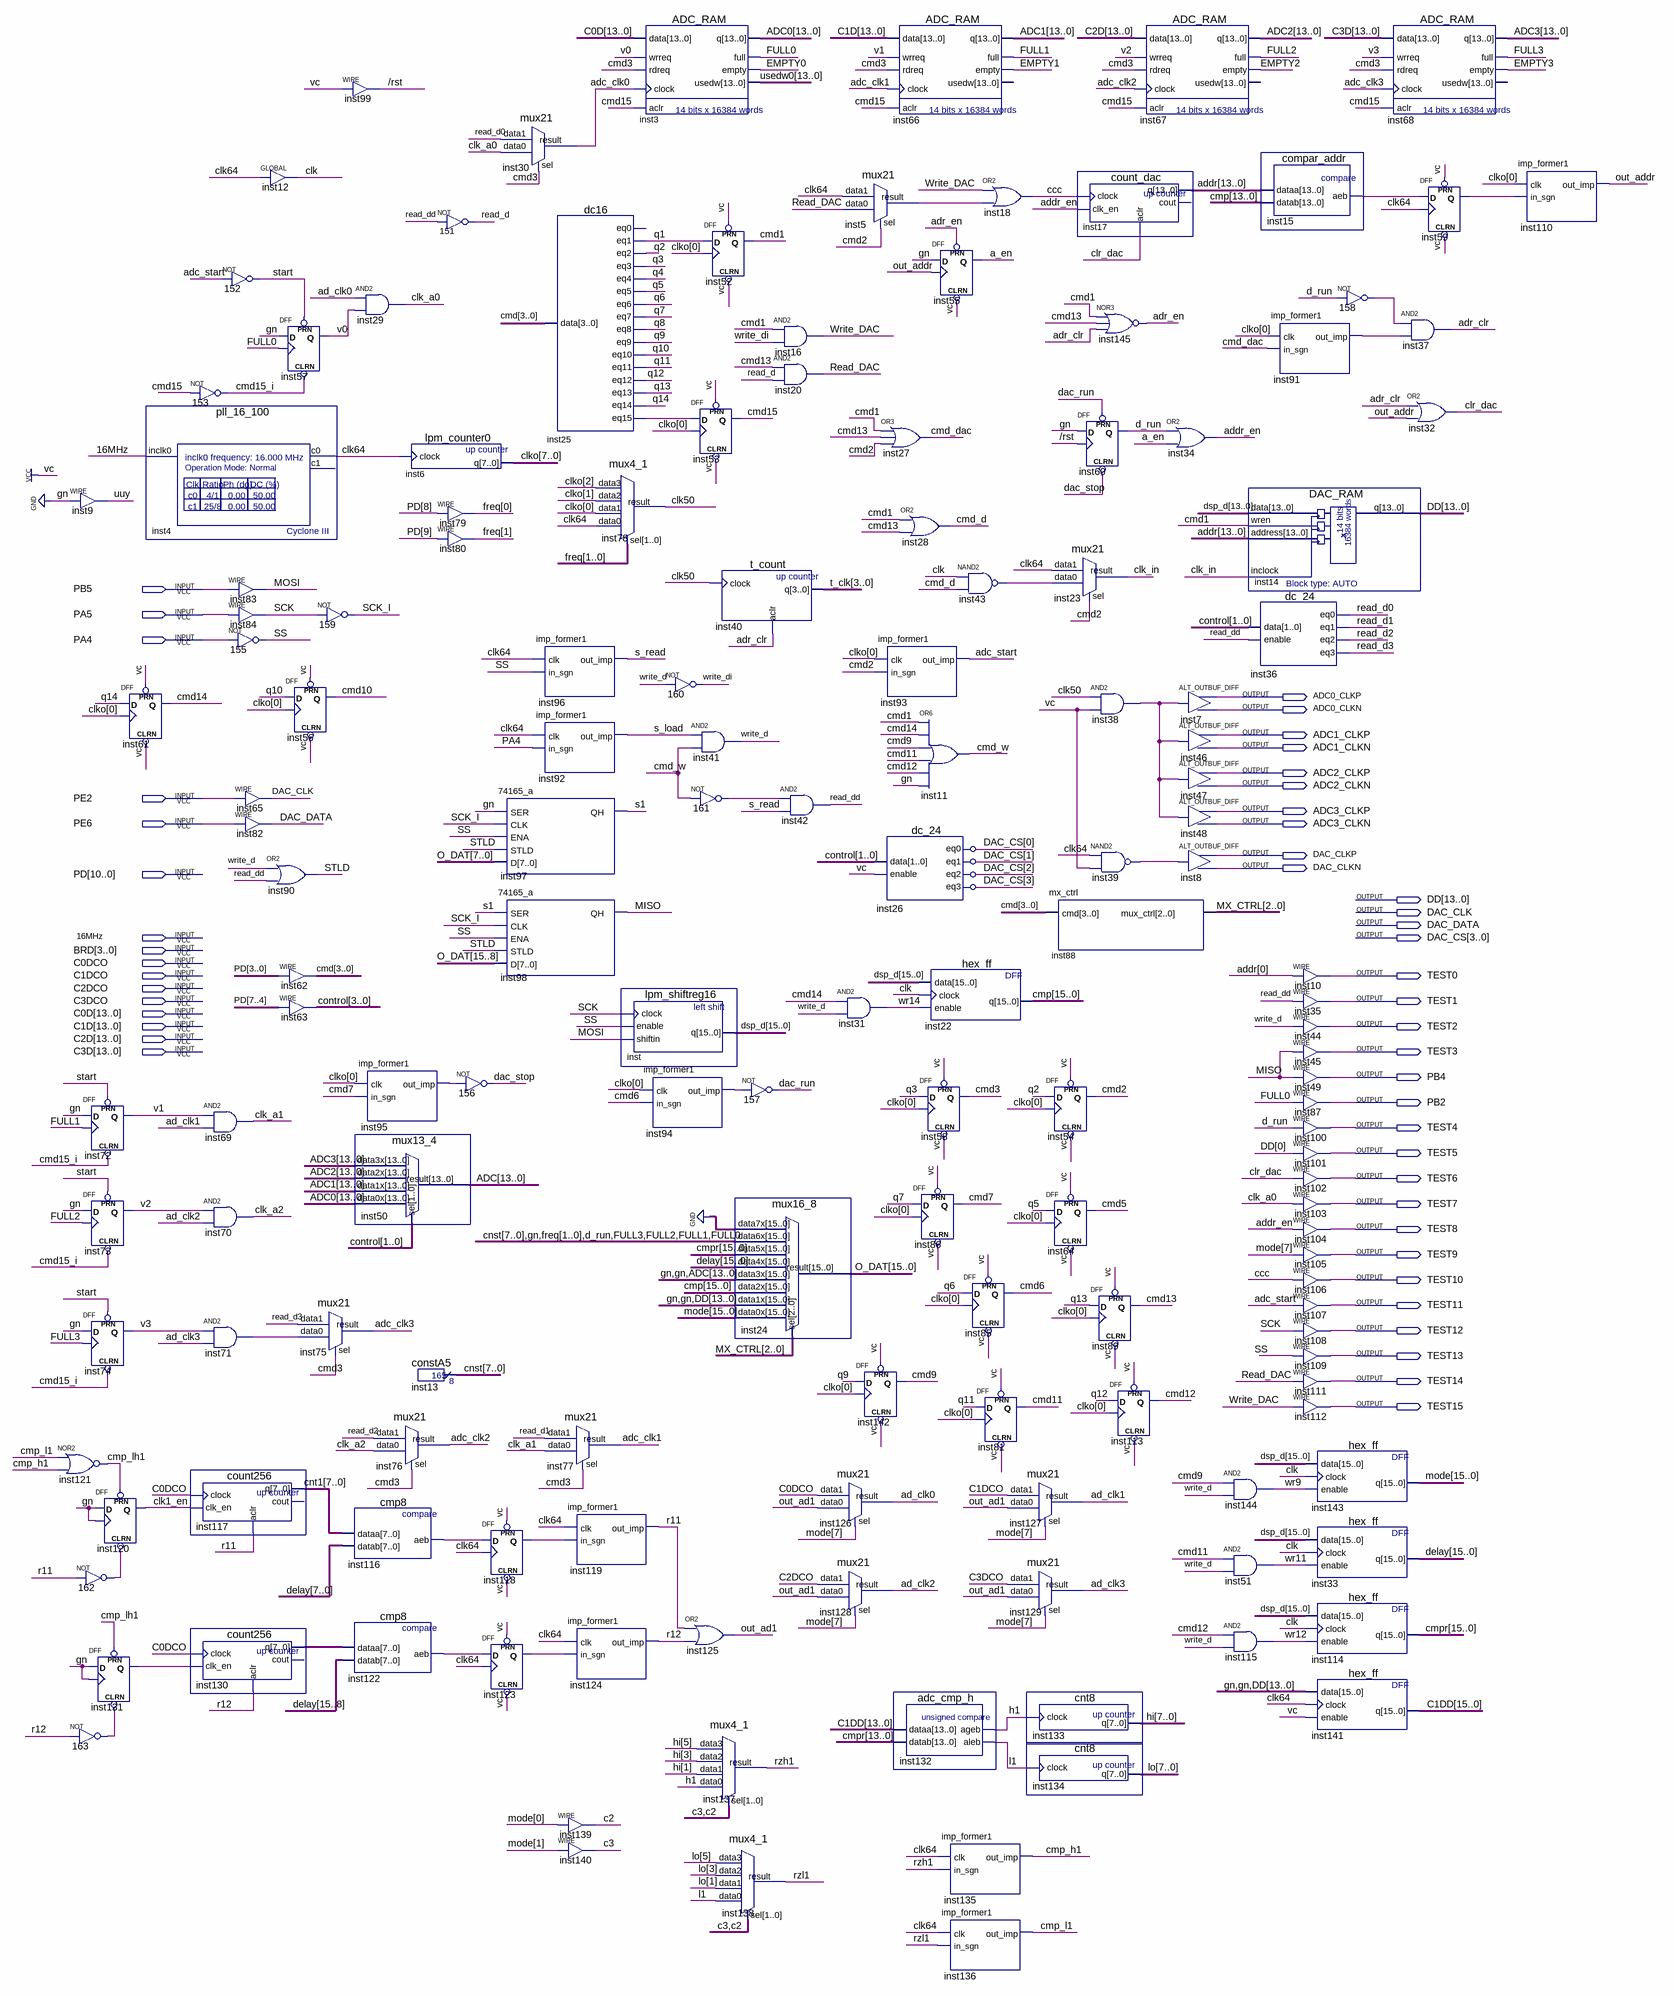
[diagram p0: schematic sheet]
// Quartus schematic Eddy_c.bdf as structural Verilog: 154 symbols, 48 pins
module Eddy_c (
  input  PB5,
  input  PA5,
  input  PA4,
  input  PE2,
  input  PE6,
  input  [10:0] PD,
  input  \16MHz ,
  input  [3:0] BRD,
  input  C0DCO,
  input  C1DCO,
  input  C2DCO,
  input  C3DCO,
  input  [13:0] C0D,
  input  [13:0] C1D,
  input  [13:0] C2D,
  input  [13:0] C3D,
  output ADC0_CLKP,
  output ADC0_CLKN,
  output ADC1_CLKP,
  output ADC1_CLKN,
  output ADC2_CLKP,
  output ADC2_CLKN,
  output ADC3_CLKP,
  output ADC3_CLKN,
  output DAC_CLKP,
  output DAC_CLKN,
  output [13:0] DD,
  output DAC_CLK,
  output DAC_DATA,
  output [3:0] DAC_CS,
  output TEST0,
  output TEST1,
  output TEST2,
  output TEST3,
  output PB4,
  output PB2,
  output TEST4,
  output TEST5,
  output TEST6,
  output TEST7,
  output TEST8,
  output TEST9,
  output TEST10,
  output TEST11,
  output TEST12,
  output TEST13,
  output TEST14,
  output TEST15
);

  wire \/rst , a_en, ad_clk0, ad_clk1, ad_clk2, ad_clk3, adc_clk0, adc_clk1, adc_clk2, adc_clk3, adc_start,
       addr_en, adr_clr, adr_en, c2, c3, ccc, clk, clk1_en, clk50, clk64, clk_a0, clk_a1, clk_a2, clk_in,
       clr_dac, cmd5, cmd6, cmd7, cmd9, cmd10, cmd11, cmd12, cmd13, cmd14, cmd15, cmd15_i, cmd_d, cmd_dac,
       cmd_w, cmp_h1, cmp_l1, cmp_lh1, d_run, dac_run, dac_stop, EMPTY0, EMPTY1, EMPTY2, EMPTY3, FULL0,
       FULL1, FULL2, FULL3, h1, inst5_result, inst15_aeb, inst25_eq15, inst26_eq0, inst26_eq1, inst26_eq2,
       inst26_eq3, inst38_out, inst39_out, inst43_out, inst59_q, inst71_out, inst91_out_imp, inst94_out_imp,
       inst95_out_imp, inst116_aeb, inst118_q, inst122_aeb, inst123_q, inst131_q, l1, MISO, MOSI, n158_out,
       n161_out, n162_out, n163_out, out_ad1, out_addr, q1, q2, q3, q4, q5, q6, q7, q8, q9, q10, q11, q12,
       q13, q14, r11, r12, read_d, read_d0, read_d1, read_d2, read_d3, Read_DAC, read_dd, rzh1, rzl1, s1,
       s_load, s_read, SCK, SCK_I, SS, start, STLD, uuy, v0, v1, v2, v3, wr9, wr11, wr12, wr14, write_d,
       Write_DAC, write_di;
  wire [1:0] freq;
  wire [2:0] MX_CTRL;
  wire [3:0] cmd, control, t_clk;
  wire [7:0] clko, cnst, cnt1, hi, inst130_q, lo;
  wire [13:0] ADC, ADC0, ADC1, ADC2, ADC3, addr, usedw0;
  wire [15:0] C1DD, cmp, cmpr, delay, dsp_d, mode, O_DAT;

  assign uuy = 1'b0;  // WIRE inst9
  nor inst121 (cmp_lh1, cmp_l1, cmp_h1);
  not u_162 (n162_out, r11);
  not u_163 (n163_out, r12);
  DFF inst61 (.CLRN(1'b1), .CLK(clko[0]), .D(q14), .PRN(1'b1), .Q(cmd14));
  DFF inst72 (.CLRN(cmd15_i), .CLK(FULL1), .D(1'b0), .PRN(start), .Q(v1));
  DFF inst73 (.CLRN(cmd15_i), .CLK(FULL2), .D(1'b0), .PRN(start), .Q(v2));
  DFF inst74 (.CLRN(cmd15_i), .CLK(FULL3), .D(1'b0), .PRN(start), .Q(v3));
  DFF inst120 (.CLRN(n162_out), .CLK(1'b0), .D(1'b0), .PRN(cmp_lh1), .Q(clk1_en));
  DFF inst131 (.CLRN(n163_out), .CLK(1'b0), .D(1'b0), .PRN(cmp_lh1), .Q(inst131_q));
  pll_16_100 inst4 (.inclk0(\16MHz ), .c0(clk64));  // open: c1
  not u_152 (start, adc_start);
  not u_153 (cmd15_i, cmd15);
  assign MOSI = PB5;  // WIRE inst83
  assign SCK = PA5;  // WIRE inst84
  not u_155 (SS, PA4);
  and inst69 (clk_a1, v1, ad_clk1);
  and inst70 (clk_a2, v2, ad_clk2);
  and inst71 (inst71_out, v3, ad_clk3);
  count256 inst117 (.clock(C0DCO), .clk_en(clk1_en), .aclr(r11), .q(cnt1));  // open: cout
  count256 inst130 (.clock(C0DCO), .clk_en(inst131_q), .aclr(r12), .q(inst130_q));  // open: cout
  GLOBAL inst12 (.IN(clk64), .OUT(clk));
  DFF inst57 (.CLRN(cmd15_i), .CLK(FULL0), .D(1'b0), .PRN(start), .Q(v0));
  assign DAC_CLK = PE2;  // WIRE inst65
  assign DAC_DATA = PE6;  // WIRE inst82
  or inst90 (STLD, write_d, read_dd);
  assign cmd = PD[3:0];  // WIRE inst62
  assign control = PD[7:4];  // WIRE inst63
  not u_159 (SCK_I, SCK);
  DFF inst56 (.CLRN(1'b1), .CLK(clko[0]), .D(q10), .PRN(1'b1), .Q(cmd10));
  mux21 inst75 (.data1(read_d3), .data0(inst71_out), .sel(cmd[3]), .result(adc_clk3));
  assign \/rst  = 1'b1;  // WIRE inst99
  and inst29 (clk_a0, ad_clk0, v0);
  imp_former1 inst95 (.clk(clko[0]), .in_sgn(cmd7), .out_imp(inst95_out_imp));
  mux13_4 inst50 (.data3x(ADC3), .data2x(ADC2), .data1x(ADC1), .data0x(ADC0), .sel(control[1:0]), .result(ADC));
  mux21 inst76 (.data1(read_d2), .data0(clk_a2), .sel(cmd[3]), .result(adc_clk2));
  cmp8 inst116 (.dataa(cnt1), .datab(delay[7:0]), .aeb(inst116_aeb));
  cmp8 inst122 (.dataa(inst130_q), .datab(delay[15:8]), .aeb(inst122_aeb));
  lpm_counter0 inst6 (.clock(clk64), .q(clko));
  constA5 inst13 (.result(cnst));
  not u_151 (read_d, read_dd);
  assign freq[0] = PD[8];  // WIRE inst79
  assign freq[1] = PD[9];  // WIRE inst80
  not u_156 (dac_stop, inst95_out_imp);
  DFF inst118 (.CLRN(1'b1), .CLK(clk64), .D(inst116_aeb), .PRN(1'b1), .Q(inst118_q));
  DFF inst123 (.CLRN(1'b1), .CLK(clk64), .D(inst122_aeb), .PRN(1'b1), .Q(inst123_q));
  mux21 inst30 (.data1(read_d0), .data0(clk_a0), .sel(cmd[3]), .result(adc_clk0));
  imp_former1 inst96 (.clk(clk64), .in_sgn(SS), .out_imp(s_read));
  imp_former1 inst92 (.clk(clk64), .in_sgn(PA4), .out_imp(s_load));
  \74165_a  inst97 (.SER(1'b0), .CLK(SCK_I), .ENA(SS), .STLD(STLD), .D(O_DAT[7:0]), .QH(s1));
  \74165_a  inst98 (.SER(s1), .CLK(SCK_I), .ENA(SS), .STLD(STLD), .D(O_DAT[15:8]), .QH(MISO));
  dc16 inst25 (
    .data(cmd), .eq1(q1), .eq2(q2), .eq3(q3), .eq4(q4), .eq5(q5), .eq6(q6), .eq7(q7), .eq8(q8), .eq9(q9),
    .eq10(q10), .eq11(q11), .eq12(q12), .eq13(q13), .eq14(q14), .eq15(inst25_eq15));  // open: eq0
  mux21 inst77 (.data1(read_d1), .data0(clk_a1), .sel(cmd[3]), .result(adc_clk1));
  imp_former1 inst119 (.clk(clk64), .in_sgn(inst118_q), .out_imp(r11));
  imp_former1 inst124 (.clk(clk64), .in_sgn(inst123_q), .out_imp(r12));
  assign c2 = mode[0];  // WIRE inst139
  assign c3 = mode[1];  // WIRE inst140
  ADC_RAM inst3 (
    .data(C0D), .wrreq(v0), .rdreq(cmd[3]), .clock(adc_clk0), .aclr(cmd15), .q(ADC0), .full(FULL0),
    .empty(EMPTY0), .usedw(usedw0));
  mux4_1 inst78 (.data3(clko[2]), .data2(clko[1]), .data1(clko[0]), .data0(clk64), .sel(freq), .result(clk50));
  lpm_shiftreg16 inst (.clock(SCK), .enable(SS), .shiftin(MOSI), .q(dsp_d));
  not u_160 (write_di, write_d);
  imp_former1 inst94 (.clk(clko[0]), .in_sgn(cmd6), .out_imp(inst94_out_imp));
  or inst125 (out_ad1, r11, r12);
  DFF inst52 (.CLRN(1'b1), .CLK(clko[0]), .D(q1), .PRN(1'b1), .Q(cmd[1]));
  DFF inst53 (.CLRN(1'b1), .CLK(clko[0]), .D(inst25_eq15), .PRN(1'b1), .Q(cmd15));
  t_count inst40 (.clock(clk50), .aclr(adr_clr), .q(t_clk));
  and inst41 (write_d, s_load, cmd_w);
  not u_161 (n161_out, cmd_w);
  mux16_8 inst24 (
    .data7x({16{1'b0}}), .data6x({cnst, 1'b0, freq, d_run, FULL3, FULL2, FULL1, FULL0}), .data5x(cmpr),
    .data4x(delay), .data3x({2'b00, ADC}), .data2x(cmp), .data1x({2'b00, DD}), .data0x(mode), .sel(MX_CTRL),
    .result(O_DAT));
  mux4_1 inst137 (.data3(hi[5]), .data2(hi[3]), .data1(hi[1]), .data0(h1), .sel({c3, c2}), .result(rzh1));
  mux4_1 inst138 (.data3(lo[5]), .data2(lo[3]), .data1(lo[1]), .data0(l1), .sel({c3, c2}), .result(rzl1));
  and inst16 (Write_DAC, cmd[1], write_di);
  and inst20 (Read_DAC, cmd13, read_d);
  and inst42 (read_dd, n161_out, s_read);
  not u_157 (dac_run, inst94_out_imp);
  and inst31 (wr14, cmd14, write_d);
  mux21 inst126 (.data1(C0DCO), .data0(out_ad1), .sel(mode[7]), .result(ad_clk0));
  mux21 inst128 (.data1(C2DCO), .data0(out_ad1), .sel(mode[7]), .result(ad_clk2));
  ADC_RAM inst66 (
    .data(C1D), .wrreq(v1), .rdreq(cmd[3]), .clock(adc_clk1), .aclr(cmd15), .q(ADC1), .full(FULL1),
    .empty(EMPTY1));  // open: usedw
  mux21 inst5 (.data1(clk64), .data0(Read_DAC), .sel(cmd[2]), .result(inst5_result));
  or inst27 (cmd_dac, cmd[1], cmd13, cmd[2]);
  imp_former1 inst93 (.clk(clko[0]), .in_sgn(cmd[2]), .out_imp(adc_start));
  dc_24 inst26 (
    .data(control[1:0]), .enable(1'b1), .eq0(inst26_eq0), .eq1(inst26_eq1), .eq2(inst26_eq2), .eq3(inst26_eq3));
  not inst26_eq0_inverted (DAC_CS[0], inst26_eq0);
  not inst26_eq1_inverted (DAC_CS[1], inst26_eq1);
  not inst26_eq2_inverted (DAC_CS[2], inst26_eq2);
  not inst26_eq3_inverted (DAC_CS[3], inst26_eq3);
  DFF inst142 (.CLRN(1'b1), .CLK(clko[0]), .D(q9), .PRN(1'b1), .Q(cmd9));
  DFF inst55 (.CLRN(1'b1), .CLK(out_addr), .D(1'b0), .PRN(adr_en), .Q(a_en));
  or inst28 (cmd_d, cmd[1], cmd13);
  or inst11 (cmd_w, cmd[1], cmd14, cmd9, cmd11, cmd12, 1'b0);
  hex_ff inst22 (.data(dsp_d), .clock(clk), .enable(wr14), .q(cmp));
  DFF inst58 (.CLRN(1'b1), .CLK(clko[0]), .D(q3), .PRN(1'b1), .Q(cmd[3]));
  DFF inst86 (.CLRN(1'b1), .CLK(clko[0]), .D(q7), .PRN(1'b1), .Q(cmd7));
  adc_cmp_h inst132 (.dataa(C1DD[13:0]), .datab(cmpr[13:0]), .ageb(h1), .aleb(l1));
  imp_former1 inst135 (.clk(clk64), .in_sgn(rzh1), .out_imp(cmp_h1));
  imp_former1 inst136 (.clk(clk64), .in_sgn(rzl1), .out_imp(cmp_l1));
  or inst18 (ccc, Write_DAC, inst5_result);
  nand inst43 (inst43_out, clk, cmd_d);
  DFF inst85 (.CLRN(1'b1), .CLK(clko[0]), .D(q6), .PRN(1'b1), .Q(cmd6));
  DFF inst81 (.CLRN(1'b1), .CLK(clko[0]), .D(q11), .PRN(1'b1), .Q(cmd11));
  mux21 inst127 (.data1(C1DCO), .data0(out_ad1), .sel(mode[7]), .result(ad_clk1));
  mux21 inst129 (.data1(C3DCO), .data0(out_ad1), .sel(mode[7]), .result(ad_clk3));
  cnt8 inst133 (.clock(h1), .q(hi));
  cnt8 inst134 (.clock(l1), .q(lo));
  count_dac inst17 (.clock(ccc), .clk_en(addr_en), .aclr(clr_dac), .q(addr));  // open: cout
  DFF inst60 (.CLRN(dac_stop), .CLK(\/rst ), .D(1'b0), .PRN(dac_run), .Q(d_run));
  mux21 inst23 (.data1(clk64), .data0(inst43_out), .sel(cmd[2]), .result(clk_in));
  and inst38 (inst38_out, clk50, 1'b1);
  nand inst39 (inst39_out, clk64, 1'b1);
  mx_ctrl inst88 (.cmd(cmd), .mux_ctrl(MX_CTRL));
  DFF inst54 (.CLRN(1'b1), .CLK(clko[0]), .D(q2), .PRN(1'b1), .Q(cmd[2]));
  DFF inst64 (.CLRN(1'b1), .CLK(clko[0]), .D(q5), .PRN(1'b1), .Q(cmd5));
  DFF inst89 (.CLRN(1'b1), .CLK(clko[0]), .D(q13), .PRN(1'b1), .Q(cmd13));
  ADC_RAM inst67 (
    .data(C2D), .wrreq(v2), .rdreq(cmd[3]), .clock(adc_clk2), .aclr(cmd15), .q(ADC2), .full(FULL2),
    .empty(EMPTY2));  // open: usedw
  nor inst145 (adr_en, cmd[1], cmd13, adr_clr);
  DFF inst113 (.CLRN(1'b1), .CLK(clko[0]), .D(q12), .PRN(1'b1), .Q(cmd12));
  or inst34 (addr_en, d_run, a_en);
  ALT_OUTBUF_DIFF inst7 (.i(inst38_out), .obar(ADC0_CLKN), .o(ADC0_CLKP));
  ALT_OUTBUF_DIFF inst46 (.i(inst38_out), .obar(ADC1_CLKN), .o(ADC1_CLKP));
  ALT_OUTBUF_DIFF inst47 (.i(inst38_out), .obar(ADC2_CLKN), .o(ADC2_CLKP));
  ALT_OUTBUF_DIFF inst48 (.i(inst38_out), .obar(ADC3_CLKN), .o(ADC3_CLKP));
  ALT_OUTBUF_DIFF inst8 (.i(inst39_out), .obar(DAC_CLKN), .o(DAC_CLKP));
  and inst144 (wr9, cmd9, write_d);
  and inst51 (wr11, cmd11, write_d);
  and inst115 (wr12, cmd12, write_d);
  compar_addr inst15 (.dataa(addr), .datab(cmp[13:0]), .aeb(inst15_aeb));
  imp_former1 inst91 (.clk(clko[0]), .in_sgn(cmd_dac), .out_imp(inst91_out_imp));
  DAC_RAM inst14 (.data(dsp_d[13:0]), .wren(cmd[1]), .address(addr), .inclock(clk_in), .q(DD));
  dc_24 inst36 (.data(control[1:0]), .enable(read_dd), .eq0(read_d0), .eq1(read_d1), .eq2(read_d2), .eq3(read_d3));
  assign TEST0 = addr[0];  // WIRE inst10
  assign TEST1 = read_dd;  // WIRE inst35
  assign TEST2 = write_d;  // WIRE inst44
  assign TEST3 = MISO;  // WIRE inst45
  assign PB4 = MISO;  // WIRE inst49
  assign PB2 = FULL0;  // WIRE inst87
  assign TEST4 = d_run;  // WIRE inst100
  assign TEST5 = DD[0];  // WIRE inst101
  assign TEST6 = clr_dac;  // WIRE inst102
  assign TEST7 = clk_a0;  // WIRE inst103
  assign TEST8 = addr_en;  // WIRE inst104
  assign TEST9 = mode[7];  // WIRE inst105
  assign TEST10 = ccc;  // WIRE inst106
  assign TEST11 = adc_start;  // WIRE inst107
  assign TEST12 = SCK;  // WIRE inst108
  assign TEST13 = SS;  // WIRE inst109
  assign TEST14 = Read_DAC;  // WIRE inst111
  assign TEST15 = Write_DAC;  // WIRE inst112
  not u_158 (n158_out, d_run);
  hex_ff inst143 (.data(dsp_d), .clock(clk), .enable(wr9), .q(mode));
  hex_ff inst33 (.data(dsp_d), .clock(clk), .enable(wr11), .q(delay));
  hex_ff inst114 (.data(dsp_d), .clock(clk), .enable(wr12), .q(cmpr));
  hex_ff inst141 (.data({2'b00, DD}), .clock(clk64), .enable(1'b1), .q(C1DD));
  ADC_RAM inst68 (
    .data(C3D), .wrreq(v3), .rdreq(cmd[3]), .clock(adc_clk3), .aclr(cmd15), .q(ADC3), .full(FULL3),
    .empty(EMPTY3));  // open: usedw
  DFF inst59 (.CLRN(1'b1), .CLK(clk64), .D(inst15_aeb), .PRN(1'b1), .Q(inst59_q));
  and inst37 (adr_clr, n158_out, inst91_out_imp);
  or inst32 (clr_dac, adr_clr, out_addr);
  imp_former1 inst110 (.clk(clko[0]), .in_sgn(inst59_q), .out_imp(out_addr));
endmodule
